# EAGLE design single-gates-SMD (EAGLE 7.1.0)
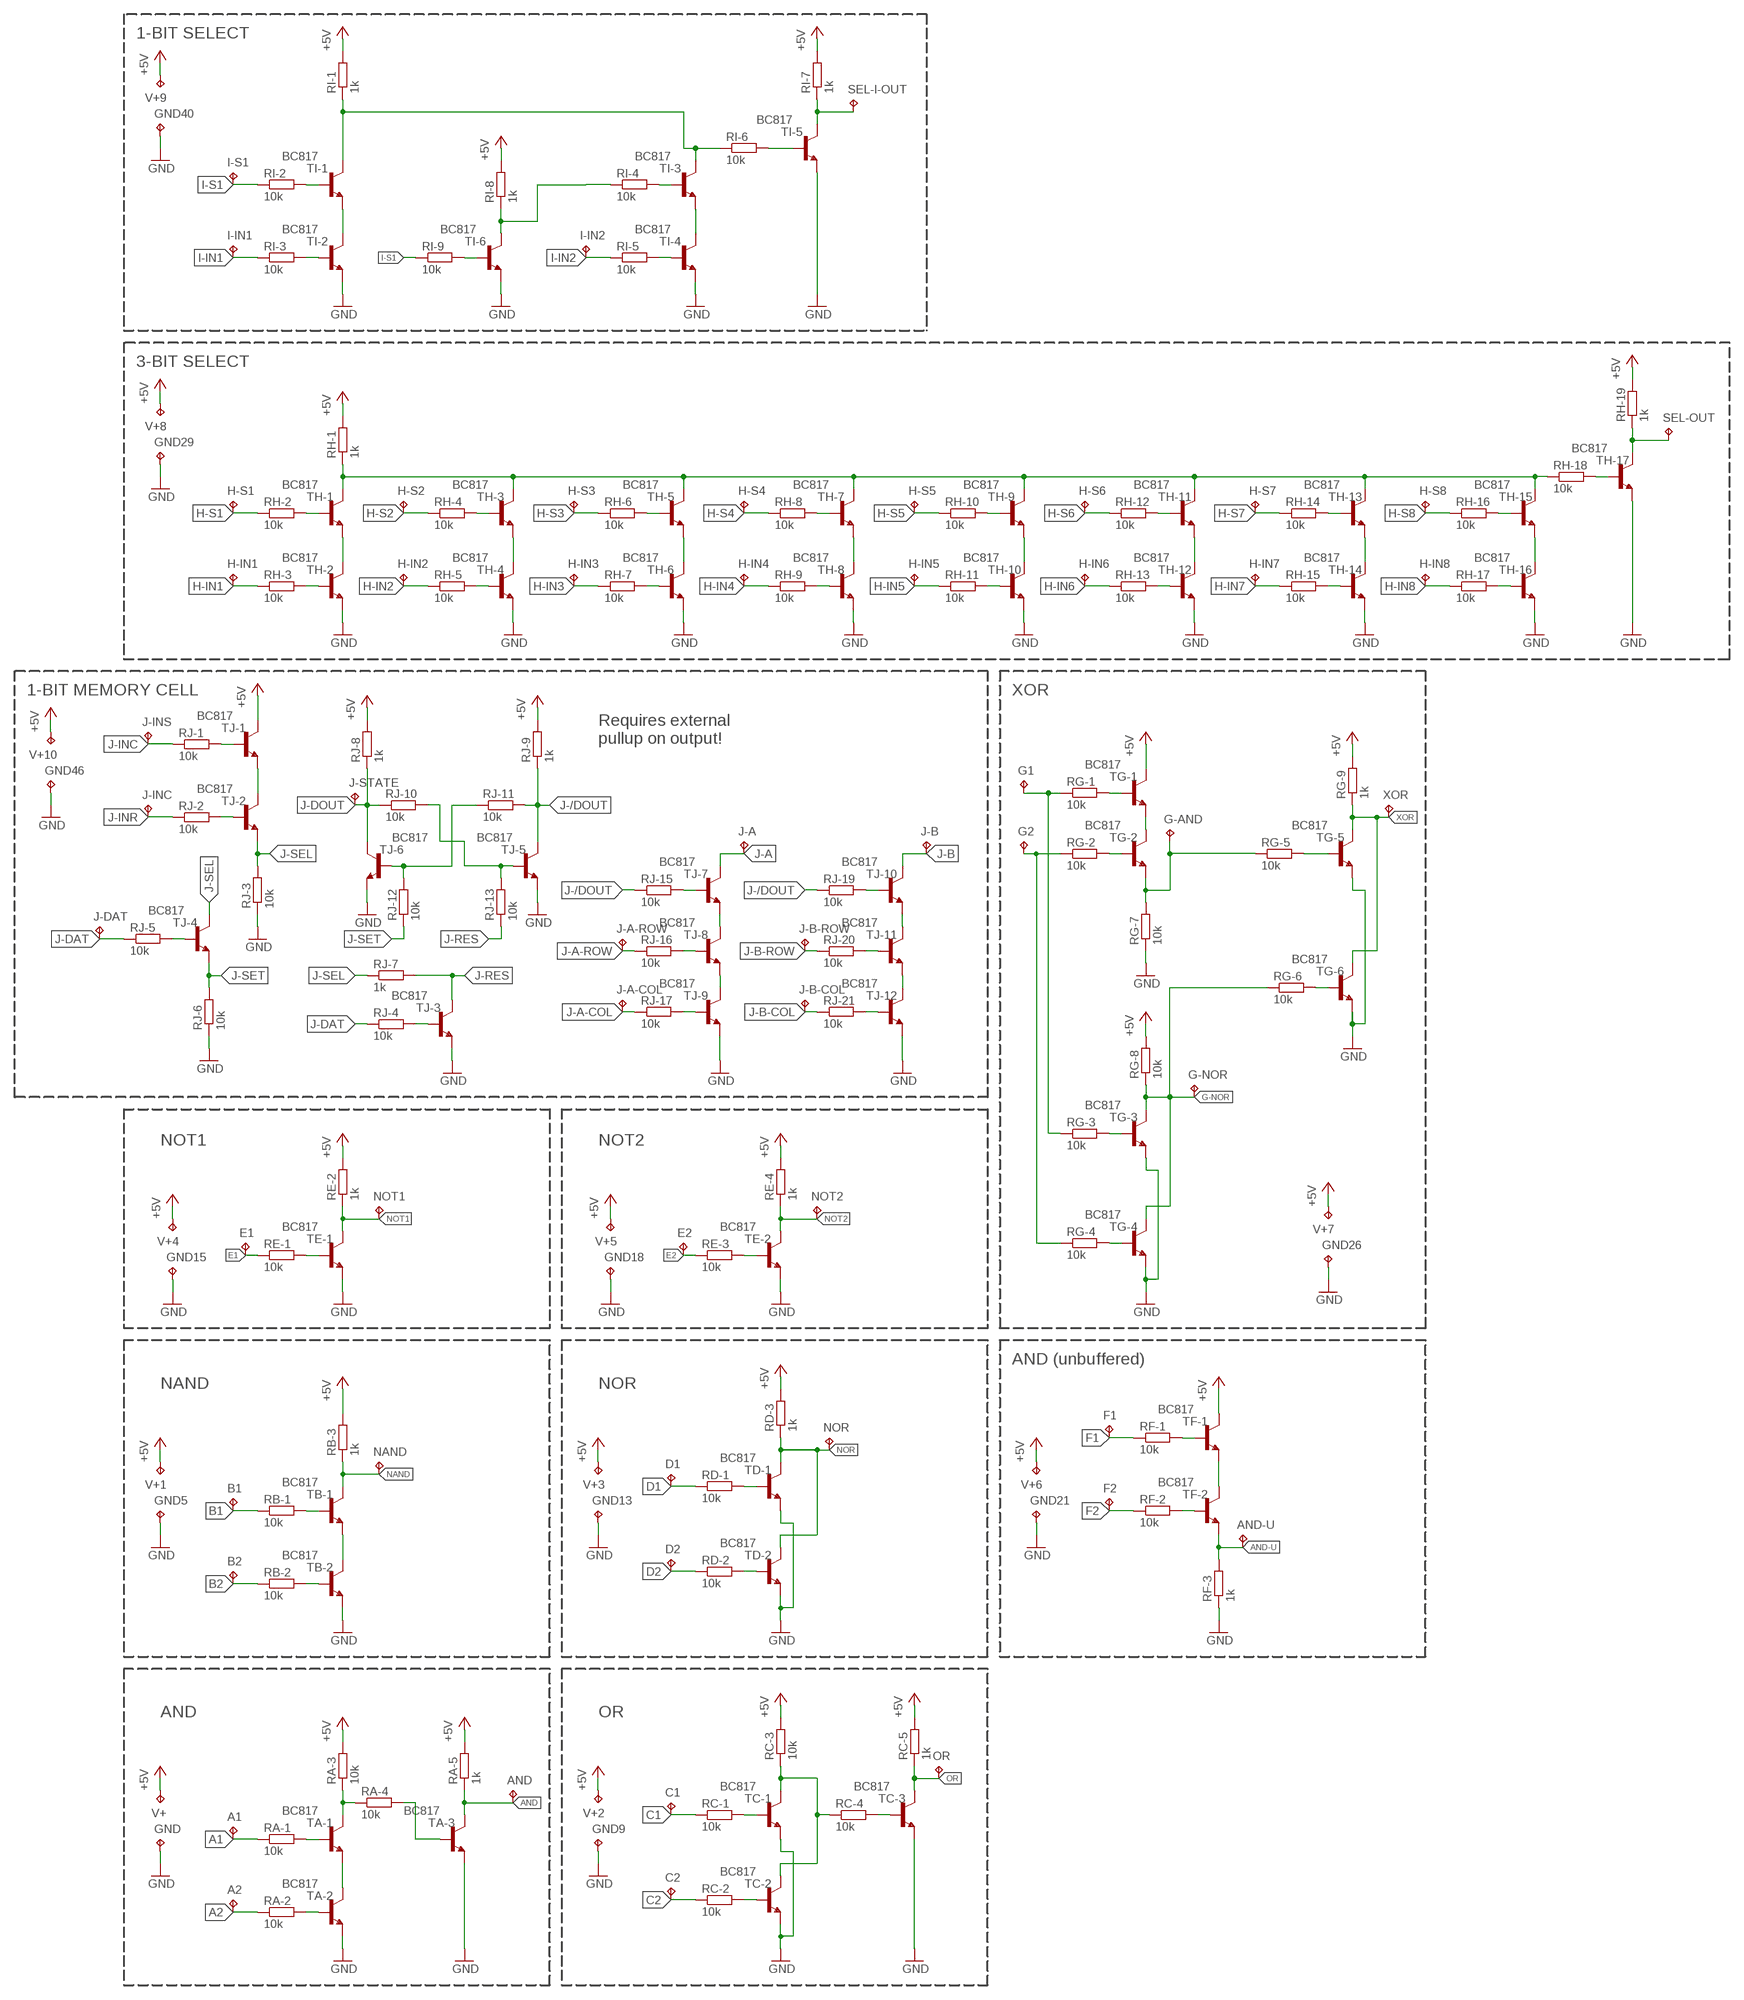
[diagram p0: schematic, sheet 1]

## Parts
A1  TPTP07R  [TP07R]
A2  TPTP07R  [TP07R]
AND  TPTP07R  [TP07R]
AND-U  TPTP07R  [TP07R]
B1  TPTP07R  [TP07R]
B2  TPTP07R  [TP07R]
C1  TPTP07R  [TP07R]
C2  TPTP07R  [TP07R]
D1  TPTP07R  [TP07R]
D2  TPTP07R  [TP07R]
E1  TPTP07R  [TP07R]
E2  TPTP07R  [TP07R]
F1  TPTP07R  [TP07R]
F2  TPTP07R  [TP07R]
G1  TPTP07R  [TP07R]
G2  TPTP07R  [TP07R]
G-AND  TPTP07R  [TP07R]
G-NOR  TPTP07R  [TP07R]
GND  TPTP07R  [TP07R]
GND5  TPTP07R  [TP07R]
GND9  TPTP07R  [TP07R]
GND13  TPTP07R  [TP07R]
GND15  TPTP07R  [TP07R]
GND18  TPTP07R  [TP07R]
GND21  TPTP07R  [TP07R]
GND26  TPTP07R  [TP07R]
GND29  TPTP07R  [TP07R]
GND40  TPTP07R  [TP07R]
GND46  TPTP07R  [TP07R]
H-IN1  TPTP07R  [TP07R]
H-IN2  TPTP07R  [TP07R]
H-IN3  TPTP07R  [TP07R]
H-IN4  TPTP07R  [TP07R]
H-IN5  TPTP07R  [TP07R]
H-IN6  TPTP07R  [TP07R]
H-IN7  TPTP07R  [TP07R]
H-IN8  TPTP07R  [TP07R]
H-S1  TPTP07R  [TP07R]
H-S2  TPTP07R  [TP07R]
H-S3  TPTP07R  [TP07R]
H-S4  TPTP07R  [TP07R]
H-S5  TPTP07R  [TP07R]
H-S6  TPTP07R  [TP07R]
H-S7  TPTP07R  [TP07R]
H-S8  TPTP07R  [TP07R]
I-IN1  TPTP07R  [TP07R]
I-IN2  TPTP07R  [TP07R]
I-S1  TPTP07R  [TP07R]
J-A  TPTP07R  [TP07R]
J-A-COL  TPTP07R  [TP07R]
J-A-ROW  TPTP07R  [TP07R]
J-B  TPTP07R  [TP07R]
J-B-COL  TPTP07R  [TP07R]
J-B-ROW  TPTP07R  [TP07R]
J-DAT  TPTP07R  [TP07R]
J-INC  TPTP07R  [TP07R]
J-INS  TPTP07R  [TP07R]
J-STATE  TPTP07R  [TP07R]
NAND  TPTP07R  [TP07R]
NOR  TPTP07R  [TP07R]
NOT1  TPTP07R  [TP07R]
NOT2  TPTP07R  [TP07R]
OR  TPTP07R  [TP07R]
RA-1  10k  R-EU_R0603  [R0603]
RA-2  10k  R-EU_R0603  [R0603]
RA-3  10k  R-EU_R0603  [R0603]
RA-4  10k  R-EU_R0603  [R0603]
RA-5  1k  R-EU_R0603  [R0603]
RB-1  10k  R-EU_R0603  [R0603]
RB-2  10k  R-EU_R0603  [R0603]
RB-3  1k  R-EU_R0603  [R0603]
RC-1  10k  R-EU_R0603  [R0603]
RC-2  10k  R-EU_R0603  [R0603]
RC-3  10k  R-EU_R0603  [R0603]
RC-4  10k  R-EU_R0603  [R0603]
RC-5  1k  R-EU_R0603  [R0603]
RD-1  10k  R-EU_R0603  [R0603]
RD-2  10k  R-EU_R0603  [R0603]
RD-3  1k  R-EU_R0603  [R0603]
RE-1  10k  R-EU_R0603  [R0603]
RE-2  1k  R-EU_R0603  [R0603]
RE-3  10k  R-EU_R0603  [R0603]
RE-4  1k  R-EU_R0603  [R0603]
RF-1  10k  R-EU_R0603  [R0603]
RF-2  10k  R-EU_R0603  [R0603]
RF-3  1k  R-EU_R0603  [R0603]
RG-1  10k  R-EU_R0603  [R0603]
RG-2  10k  R-EU_R0603  [R0603]
RG-3  10k  R-EU_R0603  [R0603]
RG-4  10k  R-EU_R0603  [R0603]
RG-5  10k  R-EU_R0603  [R0603]
RG-6  10k  R-EU_R0603  [R0603]
RG-7  10k  R-EU_R0603  [R0603]
RG-8  10k  R-EU_R0603  [R0603]
RG-9  1k  R-EU_R0603  [R0603]
RH-1  1k  R-EU_R0603  [R0603]
RH-2  10k  R-EU_R0603  [R0603]
RH-3  10k  R-EU_R0603  [R0603]
RH-4  10k  R-EU_R0603  [R0603]
RH-5  10k  R-EU_R0603  [R0603]
RH-6  10k  R-EU_R0603  [R0603]
RH-7  10k  R-EU_R0603  [R0603]
RH-8  10k  R-EU_R0603  [R0603]
RH-9  10k  R-EU_R0603  [R0603]
RH-10  10k  R-EU_R0603  [R0603]
RH-11  10k  R-EU_R0603  [R0603]
RH-12  10k  R-EU_R0603  [R0603]
RH-13  10k  R-EU_R0603  [R0603]
RH-14  10k  R-EU_R0603  [R0603]
RH-15  10k  R-EU_R0603  [R0603]
RH-16  10k  R-EU_R0603  [R0603]
RH-17  10k  R-EU_R0603  [R0603]
RH-18  10k  R-EU_R0603  [R0603]
RH-19  1k  R-EU_R0603  [R0603]
RI-1  1k  R-EU_R0603  [R0603]
RI-2  10k  R-EU_R0603  [R0603]
RI-3  10k  R-EU_R0603  [R0603]
RI-4  10k  R-EU_R0603  [R0603]
RI-5  10k  R-EU_R0603  [R0603]
RI-6  10k  R-EU_R0603  [R0603]
RI-7  1k  R-EU_R0603  [R0603]
RI-8  1k  R-EU_R0603  [R0603]
RI-9  10k  R-EU_R0603  [R0603]
RJ-1  10k  R-EU_R0603  [R0603]
RJ-2  10k  R-EU_R0603  [R0603]
RJ-3  10k  R-EU_R0603  [R0603]
RJ-4  10k  R-EU_R0603  [R0603]
RJ-5  10k  R-EU_R0603  [R0603]
RJ-6  10k  R-EU_R0603  [R0603]
RJ-7  1k  R-EU_R0603  [R0603]
RJ-8  1k  R-EU_R0603  [R0603]
RJ-9  1k  R-EU_R0603  [R0603]
RJ-10  10k  R-EU_R0603  [R0603]
RJ-11  10k  R-EU_R0603  [R0603]
RJ-12  10k  R-EU_R0603  [R0603]
RJ-13  10k  R-EU_R0603  [R0603]
RJ-15  10k  R-EU_R0603  [R0603]
RJ-16  10k  R-EU_R0603  [R0603]
RJ-17  10k  R-EU_R0603  [R0603]
RJ-19  10k  R-EU_R0603  [R0603]
RJ-20  10k  R-EU_R0603  [R0603]
RJ-21  10k  R-EU_R0603  [R0603]
SEL-I-OUT  TPTP07R  [TP07R]
SEL-OUT  TPTP07R  [TP07R]
TA-1  BC817  BC817-40-NPN-SOT23-BEC  [SOT23-BEC]
TA-2  BC817  BC817-40-NPN-SOT23-BEC  [SOT23-BEC]
TA-3  BC817  BC817-40-NPN-SOT23-BEC  [SOT23-BEC]
TB-1  BC817  BC817-40-NPN-SOT23-BEC  [SOT23-BEC]
TB-2  BC817  BC817-40-NPN-SOT23-BEC  [SOT23-BEC]
TC-1  BC817  BC817-40-NPN-SOT23-BEC  [SOT23-BEC]
TC-2  BC817  BC817-40-NPN-SOT23-BEC  [SOT23-BEC]
TC-3  BC817  BC817-40-NPN-SOT23-BEC  [SOT23-BEC]
TD-1  BC817  BC817-40-NPN-SOT23-BEC  [SOT23-BEC]
TD-2  BC817  BC817-40-NPN-SOT23-BEC  [SOT23-BEC]
TE-1  BC817  BC817-40-NPN-SOT23-BEC  [SOT23-BEC]
TE-2  BC817  BC817-40-NPN-SOT23-BEC  [SOT23-BEC]
TF-1  BC817  BC817-40-NPN-SOT23-BEC  [SOT23-BEC]
TF-2  BC817  BC817-40-NPN-SOT23-BEC  [SOT23-BEC]
TG-1  BC817  BC817-40-NPN-SOT23-BEC  [SOT23-BEC]
TG-2  BC817  BC817-40-NPN-SOT23-BEC  [SOT23-BEC]
TG-3  BC817  BC817-40-NPN-SOT23-BEC  [SOT23-BEC]
TG-4  BC817  BC817-40-NPN-SOT23-BEC  [SOT23-BEC]
TG-5  BC817  BC817-40-NPN-SOT23-BEC  [SOT23-BEC]
TG-6  BC817  BC817-40-NPN-SOT23-BEC  [SOT23-BEC]
TH-1  BC817  BC817-40-NPN-SOT23-BEC  [SOT23-BEC]
TH-2  BC817  BC817-40-NPN-SOT23-BEC  [SOT23-BEC]
TH-3  BC817  BC817-40-NPN-SOT23-BEC  [SOT23-BEC]
TH-4  BC817  BC817-40-NPN-SOT23-BEC  [SOT23-BEC]
TH-5  BC817  BC817-40-NPN-SOT23-BEC  [SOT23-BEC]
TH-6  BC817  BC817-40-NPN-SOT23-BEC  [SOT23-BEC]
TH-7  BC817  BC817-40-NPN-SOT23-BEC  [SOT23-BEC]
TH-8  BC817  BC817-40-NPN-SOT23-BEC  [SOT23-BEC]
TH-9  BC817  BC817-40-NPN-SOT23-BEC  [SOT23-BEC]
TH-10  BC817  BC817-40-NPN-SOT23-BEC  [SOT23-BEC]
TH-11  BC817  BC817-40-NPN-SOT23-BEC  [SOT23-BEC]
TH-12  BC817  BC817-40-NPN-SOT23-BEC  [SOT23-BEC]
TH-13  BC817  BC817-40-NPN-SOT23-BEC  [SOT23-BEC]
TH-14  BC817  BC817-40-NPN-SOT23-BEC  [SOT23-BEC]
TH-15  BC817  BC817-40-NPN-SOT23-BEC  [SOT23-BEC]
TH-16  BC817  BC817-40-NPN-SOT23-BEC  [SOT23-BEC]
TH-17  BC817  BC817-40-NPN-SOT23-BEC  [SOT23-BEC]
TI-1  BC817  BC817-40-NPN-SOT23-BEC  [SOT23-BEC]
TI-2  BC817  BC817-40-NPN-SOT23-BEC  [SOT23-BEC]
TI-3  BC817  BC817-40-NPN-SOT23-BEC  [SOT23-BEC]
TI-4  BC817  BC817-40-NPN-SOT23-BEC  [SOT23-BEC]
TI-5  BC817  BC817-40-NPN-SOT23-BEC  [SOT23-BEC]
TI-6  BC817  BC817-40-NPN-SOT23-BEC  [SOT23-BEC]
TJ-1  BC817  BC817-40-NPN-SOT23-BEC  [SOT23-BEC]
TJ-2  BC817  BC817-40-NPN-SOT23-BEC  [SOT23-BEC]
TJ-3  BC817  BC817-40-NPN-SOT23-BEC  [SOT23-BEC]
TJ-4  BC817  BC817-40-NPN-SOT23-BEC  [SOT23-BEC]
TJ-5  BC817  BC817-40-NPN-SOT23-BEC  [SOT23-BEC]
TJ-6  BC817  BC817-40-NPN-SOT23-BEC  [SOT23-BEC]
TJ-7  BC817  BC817-40-NPN-SOT23-BEC  [SOT23-BEC]
TJ-8  BC817  BC817-40-NPN-SOT23-BEC  [SOT23-BEC]
TJ-9  BC817  BC817-40-NPN-SOT23-BEC  [SOT23-BEC]
TJ-10  BC817  BC817-40-NPN-SOT23-BEC  [SOT23-BEC]
TJ-11  BC817  BC817-40-NPN-SOT23-BEC  [SOT23-BEC]
TJ-12  BC817  BC817-40-NPN-SOT23-BEC  [SOT23-BEC]
V+  TPTP07R  [TP07R]
V+1  TPTP07R  [TP07R]
V+2  TPTP07R  [TP07R]
V+3  TPTP07R  [TP07R]
V+4  TPTP07R  [TP07R]
V+5  TPTP07R  [TP07R]
V+6  TPTP07R  [TP07R]
V+7  TPTP07R  [TP07R]
V+8  TPTP07R  [TP07R]
V+9  TPTP07R  [TP07R]
V+10  TPTP07R  [TP07R]
XOR  TPTP07R  [TP07R]

## Nets
+5V: RA-3.2 RA-5.2 RB-3.2 RC-3.2 RC-5.2 RD-3.2 RE-2.2 RE-4.2 RG-8.2 RG-9.2 RH-1.2 RH-19.2 RI-1.2 RI-7.2 RI-8.2 RJ-8.2 RJ-9.2 TF-1.C TG-1.C TJ-1.C V+1.TP V+2.TP V+3.TP V+4.TP V+5.TP V+6.TP V+7.TP V+8.TP V+9.TP V+10.TP V+.TP
A1: A1.TP RA-1.1
A2: A2.TP RA-2.1
AND: AND.TP RA-5.1 TA-3.C
AND-U: AND-U.TP RF-3.2 TF-2.E
B1: B1.TP RB-1.1
B2: B2.TP RB-2.1
C1: C1.TP RC-1.1
C2: C2.TP RC-2.1
D1: D1.TP RD-1.1
D2: D2.TP RD-2.1
E1: E1.TP RE-1.1
E2: E2.TP RE-3.1
F1: F1.TP RF-1.1
F2: F2.TP RF-2.1
G-AND: G-AND.TP RG-5.1 RG-7.2 TG-2.E
G-NOR: G-NOR.TP RG-6.1 RG-8.1 TG-3.C TG-4.C
GND: GND5.TP GND9.TP GND13.TP GND15.TP GND18.TP GND21.TP GND26.TP GND29.TP GND40.TP GND46.TP GND.TP RF-3.1 RG-7.1 RJ-3.1 RJ-6.1 TA-2.E TA-3.E TB-2.E TC-1.E TC-2.E TC-3.E TD-1.E TD-2.E TE-1.E TE-2.E TG-3.E TG-4.E TG-5.E TG-6.E TH-2.E TH-4.E TH-6.E TH-8.E TH-10.E TH-12.E TH-14.E TH-16.E TH-17.E TI-2.E TI-4.E TI-5.E TI-6.E TJ-3.E TJ-5.E TJ-6.E TJ-9.E TJ-12.E
H-IN1: H-IN1.TP RH-3.1
H-IN2: H-IN2.TP RH-5.1
H-IN3: H-IN3.TP RH-7.1
H-IN4: H-IN4.TP RH-9.1
H-IN5: H-IN5.TP RH-11.1
H-IN6: H-IN6.TP RH-13.1
H-IN7: H-IN7.TP RH-15.1
H-IN8: H-IN8.TP RH-17.1
H-S1: H-S1.TP RH-2.1
H-S2: H-S2.TP RH-4.1
H-S3: H-S3.TP RH-6.1
H-S4: H-S4.TP RH-8.1
H-S5: H-S5.TP RH-10.1
H-S6: H-S6.TP RH-12.1
H-S7: H-S7.TP RH-14.1
H-S8: H-S8.TP RH-16.1
I-IN1: I-IN1.TP RI-3.1
I-IN2: I-IN2.TP RI-5.1
I-S1: I-S1.TP RI-2.1 RI-9.1
I-S2: RI-4.1 RI-8.1 TI-6.C
J-/DOUT: RJ-9.1 RJ-11.2 RJ-15.1 RJ-19.1 TJ-5.C
J-A: J-A.TP TJ-7.C
J-A-COL: J-A-COL.TP RJ-17.1
J-A-ROW: J-A-ROW.TP RJ-16.1
J-B: J-B.TP TJ-10.C
J-B-COL: J-B-COL.TP RJ-21.1
J-B-ROW: J-B-ROW.TP RJ-20.1
J-DAT: J-DAT.TP RJ-4.1 RJ-5.1
J-DOUT: J-STATE.TP RJ-8.1 RJ-10.1 TJ-6.C
J-INC: J-INS.TP RJ-1.1
J-INR: J-INC.TP RJ-2.1
J-RES: RJ-7.2 RJ-13.1 TJ-3.C
J-SEL: RJ-3.2 RJ-7.1 TJ-2.E TJ-4.C
J-SET: RJ-6.2 RJ-12.1 TJ-4.E
N$1: RA-1.2 TA-1.B
N$2: RA-3.1 RA-4.1 TA-1.C
N$3: RA-2.2 TA-2.B
N$4: TA-1.E TA-2.C
N$5: RB-1.2 TB-1.B
N$6: RB-2.2 TB-2.B
N$7: RC-1.2 TC-1.B
N$8: TB-1.E TB-2.C
N$9: RC-2.2 TC-2.B
N$10: RC-4.2 TC-3.B
N$11: RC-3.1 RC-4.1 TC-1.C TC-2.C
N$12: RD-1.2 TD-1.B
N$13: RD-2.2 TD-2.B
N$14: RE-1.2 TE-1.B
N$15: RA-4.2 TA-3.B
N$16: RE-3.2 TE-2.B
N$17: RF-1.2 TF-1.B
N$18: RF-2.2 TF-2.B
N$19: TG-1.E TG-2.C
N$20: TF-1.E TF-2.C
N$21: RG-1.2 TG-1.B
N$22: RG-2.2 TG-2.B
N$23: RG-4.2 TG-4.B
N$24: RG-3.2 TG-3.B
N$25: RG-6.2 TG-6.B
N$26: RG-5.2 TG-5.B
N$27: RH-2.2 TH-1.B
N$28: RH-3.2 TH-2.B
N$29: TH-1.E TH-2.C
N$30: G1.TP RG-1.1 RG-3.1
N$31: G2.TP RG-2.1 RG-4.1
N$32: RH-4.2 TH-3.B
N$33: RH-5.2 TH-4.B
N$34: TH-3.E TH-4.C
N$35: RH-6.2 TH-5.B
N$36: RH-7.2 TH-6.B
N$37: TH-5.E TH-6.C
N$38: RH-8.2 TH-7.B
N$39: RH-9.2 TH-8.B
N$40: TH-7.E TH-8.C
N$41: RH-10.2 TH-9.B
N$42: RH-11.2 TH-10.B
N$43: TH-9.E TH-10.C
N$44: RH-12.2 TH-11.B
N$45: RH-13.2 TH-12.B
N$46: TH-11.E TH-12.C
N$47: RH-14.2 TH-13.B
N$48: RH-15.2 TH-14.B
N$49: TH-13.E TH-14.C
N$50: RH-16.2 TH-15.B
N$51: RH-17.2 TH-16.B
N$52: TH-15.E TH-16.C
N$53: RI-2.2 TI-1.B
N$54: RH-18.2 TH-17.B
N$55: RI-3.2 TI-2.B
N$56: TI-1.E TI-2.C
N$57: RI-4.2 TI-3.B
N$58: RI-5.2 TI-4.B
N$59: TI-3.E TI-4.C
N$60: RI-6.2 TI-5.B
N$61: RJ-1.2 TJ-1.B
N$62: RI-9.2 TI-6.B
N$63: RJ-2.2 TJ-2.B
N$64: TJ-1.E TJ-2.C
N$65: RJ-4.2 TJ-3.B
N$66: RJ-5.2 TJ-4.B
N$67: TJ-10.E TJ-11.C
N$68: TJ-7.E TJ-8.C
N$69: RJ-11.1 RJ-12.2 TJ-6.B
N$70: RJ-10.2 RJ-13.2 TJ-5.B
N$71: TJ-8.E TJ-9.C
N$72: RJ-15.2 TJ-7.B
N$73: RJ-16.2 TJ-8.B
N$74: RJ-17.2 TJ-9.B
N$75: TJ-11.E TJ-12.C
N$76: RJ-19.2 TJ-10.B
N$77: RJ-20.2 TJ-11.B
N$78: RJ-21.2 TJ-12.B
NAND: NAND.TP RB-3.1 TB-1.C
NOR: NOR.TP RD-3.1 TD-1.C TD-2.C
NOT1: NOT1.TP RE-2.1 TE-1.C
NOT2: NOT2.TP RE-4.1 TE-2.C
OR: OR.TP RC-5.1 TC-3.C
SEL_INT: RH-1.1 RH-18.1 TH-1.C TH-3.C TH-5.C TH-7.C TH-9.C TH-11.C TH-13.C TH-15.C
SEL_INT1: RI-1.1 RI-6.1 TI-1.C TI-3.C
SEL_OUT: RH-19.1 SEL-OUT.TP TH-17.C
SEL_OUT1: RI-7.1 SEL-I-OUT.TP TI-5.C
XOR: RG-9.1 TG-5.C TG-6.C XOR.TP

## Notes on the sheet
- 1-BIT SELECT
- 3-BIT SELECT
- 1-BIT MEMORY CELL | XOR
- Requires external
  pullup on output!
- NOT1 | NOT2
- AND (unbuffered)
- NAND | NOR
- AND | OR

## Library data of the parts
A1 A2 AND AND-U B1 B2 C1 C2 D1 D2 E1 E2 F1 F2 G1 G2 G-AND G-NOR GND GND5 GND9 GND13 GND15 GND18 GND21 GND26 GND29 GND40 GND46 H-IN1-H-IN8 H-S1-H-S8 I-IN1 I-IN2 I-S1 J-A J-A-COL J-A-ROW J-B J-B-COL J-B-ROW J-DAT J-INC J-INS J-STATE NAND NOR NOT1 NOT2 OR SEL-I-OUT SEL-OUT V+ V+1-V+10 XOR = testpad:TP: Test pad
RA-1-RA-5 RB-1-RB-3 RC-1-RC-5 RD-1-RD-3 RE-1-RE-4 RF-1-RF-3 RG-1-RG-9 RH-1-RH-19 RI-1-RI-9 RJ-1-RJ-13 RJ-15-RJ-17 RJ-19-RJ-21 = p.peter-rcl:R-EU_: RESISTOR, European symbol
TA-1-TA-3 TB-1 TB-2 TC-1-TC-3 TD-1 TD-2 TE-1 TE-2 TF-1 TF-2 TG-1-TG-6 TH-1-TH-17 TI-1-TI-6 TJ-1-TJ-12 = transistor:*-NPN-: NPN Transistror BF959 corrected 2008.03.06

## Board
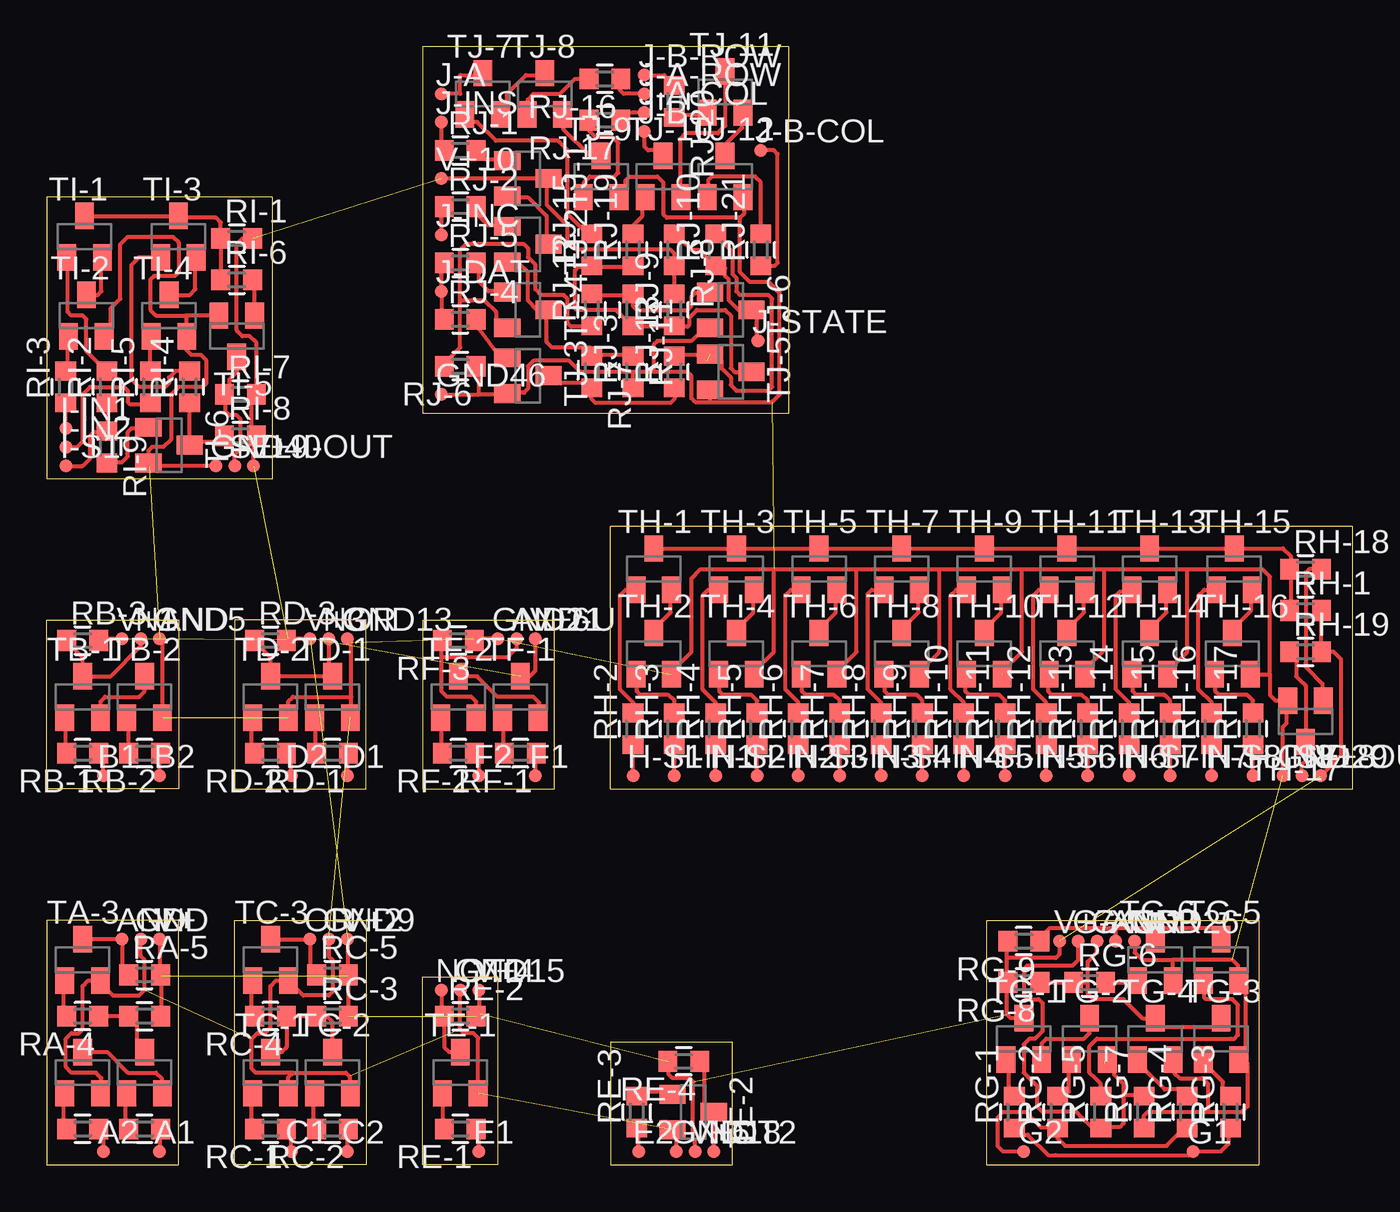
[diagram p1: board, top side]
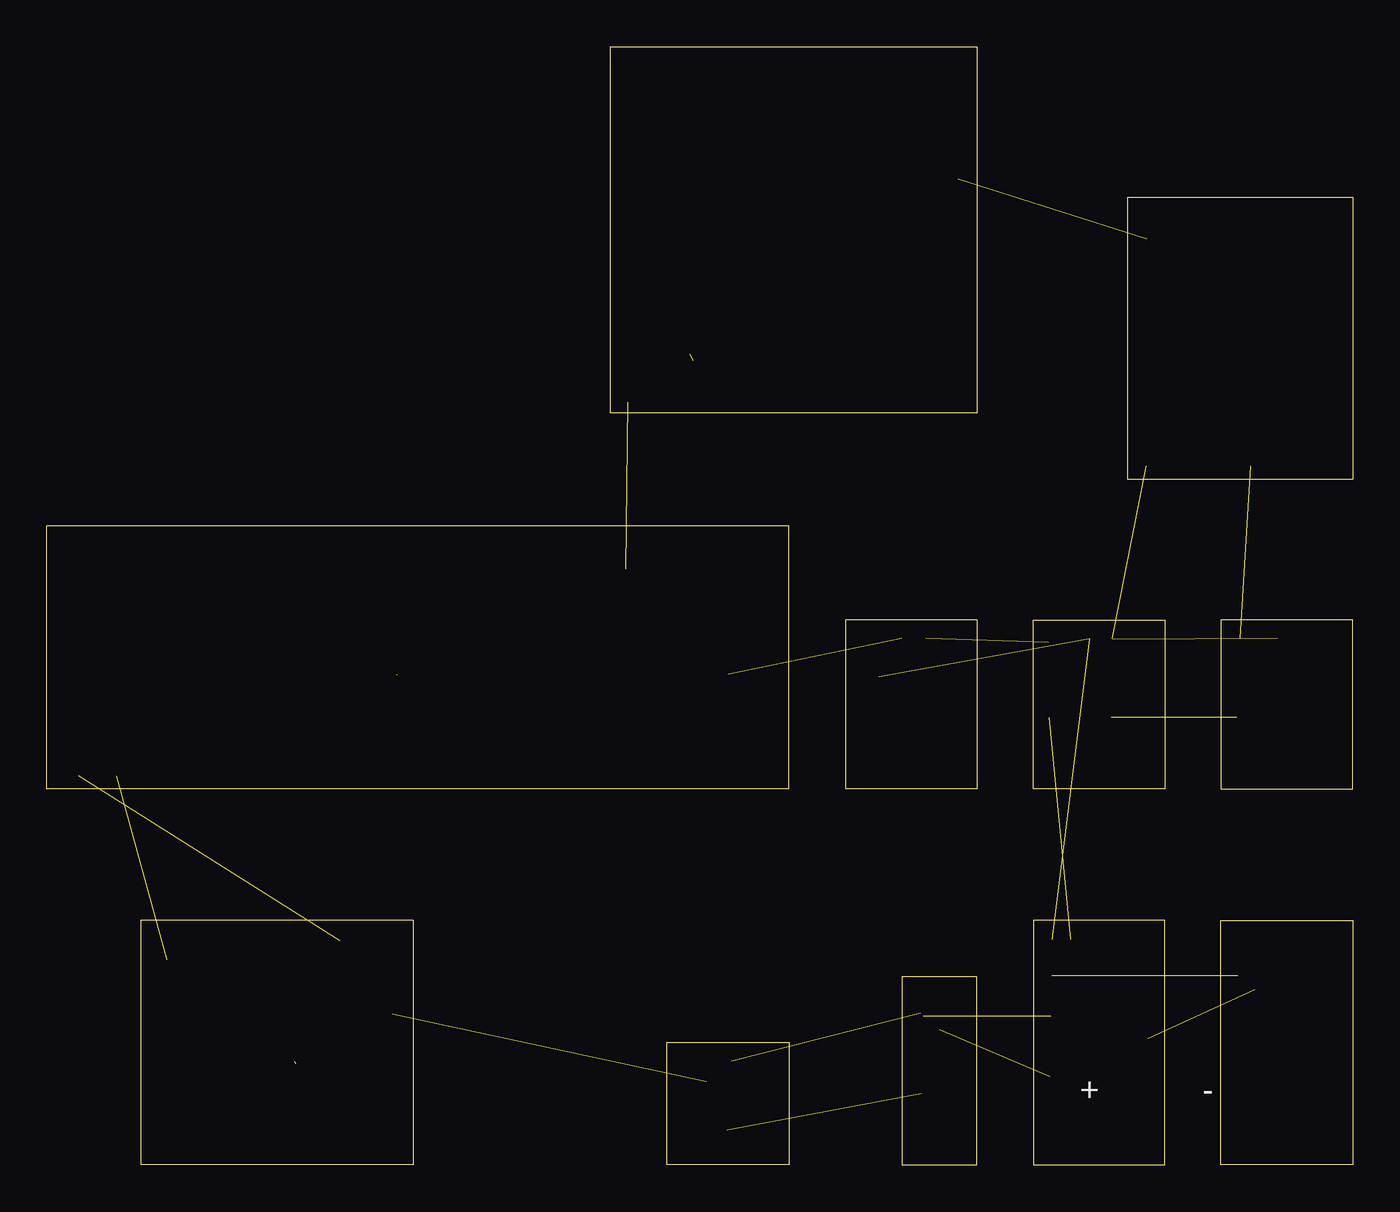
[diagram p2: board, bottom side, seen from below]

Size 69.5 x 59.5 mm. Coordinates in mm from the lower left corner, seen from the top.
Outline: 0,0 7,0 7,13 0,13 0,0
Outline: 0,20 0,29 7,29 7,20 0,20
Outline: 10,0 10,13 17,13 17,0 10,0
Outline: 10,20 17,20 17,29 10,29 10,20
Outline: 20,0 20,10 24,10 24,0 20,0
Outline: 30,0 36.5,0 36.5,6.5 30,6.5 30,0
Outline: 20,29 20,20 27,20 27,29 20,29
Outline: 50,13 50,0 64.5,0 64.5,13 50,13
Outline: 30,20 69.5,20 69.5,34 30,34 30,20
Outline: 12,36.5 0,36.5 0,51.5 12,51.5 12,36.5
Outline: 20,40 39.5,40 39.5,59.5 20,59.5 20,40
Copper layers (1*16): Top 0.035mm / dielectric 1.5mm / Bottom 0.035mm
Design rules "Fusion_eagle_rule_v1.1 *": minimum track width 6mil, minimum drill 12mil, track to track 6mil, track to pad 6mil, pad to pad 6mil, via to via 6mil, smd to smd 0mil, copper to edge 10mil, drill to drill 10mil, minimum pad ring 15mil, minimum via ring 6mil, stop-mask expansion 2mil, vias tented up to drill 100mil, thermal gap 10mil

### Footprints (pad centres in the part's own frame; a part is rotated, then mirrored left to right if it is on the bottom)
TP07R = smd 0.7 x 0.7: TP 0,0
R0603 = smd 1 x 1.1: 1 -0.85,0; 2 0.85,0
SOT23-BEC = smd 1 x 1.4: B -0.95,-1.1; C 0,1.1; E 0.95,-1.1

### Placement (x,y rotation side)
A1  6,0.7 0 top
A2  3,0.7 0 top
AND  4,12 0 top
AND-U  25,28 0 top
B1  3,20.7 0 top
B2  6,20.7 0 top
C1  13,0.7 0 top
C2  16,0.7 0 top
D1  16,20.7 0 top
D2  13,20.7 0 top
E1  23,0.7 0 top
E2  31.5,0.7 0 top
F1  26,20.7 0 top
F2  23,20.7 0 top
G1  61,0.7 0 top
G2  52,0.7 0 top
G-AND  54.9,11.9 0 top
G-NOR  55.9,11.9 0 top
GND  5,12 0 top
GND5  6,28 0 top
GND9  15,12 0 top
GND13  16,28 0 top
GND15  22,9.3 0 top
GND18  33.5,0.7 0 top
GND21  24,28 0 top
GND26  57.9,11.9 0 top
GND29  65.8,20.7 0 top
GND40  9,37.2 0 top
GND46  21,41 0 top
H-IN1  33.4,20.7 0 top
H-IN2  37.8,20.7 0 top
H-IN3  42.2,20.7 0 top
H-IN4  46.6,20.7 0 top
H-IN5  51,20.7 0 top
H-IN6  55.4,20.7 0 top
H-IN7  59.8,20.7 0 top
H-IN8  64.2,20.7 0 top
H-S1  31.2,20.7 0 top
H-S2  35.6,20.7 0 top
H-S3  40,20.7 0 top
H-S4  44.4,20.7 0 top
H-S5  48.8,20.7 0 top
H-S6  53.2,20.7 0 top
H-S7  57.6,20.7 0 top
H-S8  62,20.7 0 top
I-IN1  1,39.2 0 top
I-IN2  1,38.2 0 top
I-S1  1,37.2 0 top
J-A  21,57 0 top
J-A-COL  31.8,56 0 top
J-A-ROW  31.8,57 0 top
J-B  31.8,55 0 top
J-B-COL  38,54 0 top
J-B-ROW  31.8,58 0 top
J-DAT  21,46.5 0 top
J-INC  21,49.5 0 top
J-INS  21,55.5 0 top
J-STATE  37.85,43.85 0 top
NAND  5,28 0 top
NOR  15,28 0 top
NOT1  21,9.3 0 top
NOT2  35.5,0.7 0 top
OR  14,12 0 top
RA-1  5.2,1.9 180 top
RA-2  1.9,1.9 180 top
RA-3  5.2,7.9 0 top
RA-4  1.9,7.9 180 top
RA-5  5.2,10.1 0 top
RB-1  1.9,21.9 180 top
RB-2  5.2,21.9 180 top
RB-3  1.9,27.9 0 top
RC-1  11.9,1.9 180 top
RC-2  15.2,1.9 180 top
RC-3  15.2,7.9 0 top
RC-4  11.9,7.9 180 top
RC-5  15.2,10.1 0 top
RD-1  15.2,21.9 180 top
RD-2  11.9,21.9 180 top
RD-3  11.9,27.9 0 top
RE-1  22,1.9 180 top
RE-2  22,7.9 0 top
RE-3  31.4,2.8 90 top
RE-4  33.9,5.5 180 top
RF-1  25.2,21.9 180 top
RF-2  21.9,21.9 180 top
RF-3  21.9,27.9 180 top
RG-1  51.5,2.8 90 top
RG-2  53.8,2.8 90 top
RG-3  63,2.8 90 top
RG-4  60.7,2.8 90 top
RG-5  56.1,2.8 90 top
RG-6  55.5,9.7 0 top
RG-7  58.4,2.8 90 top
RG-8  52,9.7 180 top
RG-9  52,11.9 180 top
RH-1  67,29.5 0 top
RH-2  31.2,23.2 90 top
RH-3  33.4,23.2 90 top
RH-4  35.6,23.2 90 top
RH-5  37.8,23.2 90 top
RH-6  40,23.2 90 top
RH-7  42.2,23.2 90 top
RH-8  44.4,23.2 90 top
RH-9  46.6,23.2 90 top
RH-10  48.8,23.2 90 top
RH-11  51,23.2 90 top
RH-12  53.2,23.2 90 top
RH-13  55.4,23.2 90 top
RH-14  57.6,23.2 90 top
RH-15  59.8,23.2 90 top
RH-16  62,23.2 90 top
RH-17  64.2,23.2 90 top
RH-18  67,31.7 0 top
RH-19  67,27.3 0 top
RI-1  10.1,49.3 0 top
RI-2  3.2,41.4 90 top
RI-3  1,41.4 90 top
RI-4  7.6,41.4 90 top
RI-5  5.5,41.4 90 top
RI-6  10.1,47.1 0 top
RI-7  10.3,41 0 top
RI-8  10.3,38.8 0 top
RI-9  3.2,38.2 270 top
RJ-1  22,54 0 top
RJ-2  22,51 0 top
RJ-3  31.2,42.2 90 top
RJ-4  22,45 0 top
RJ-5  22,48 0 top
RJ-6  22,42.5 180 top
RJ-7  29,42.2 270 top
RJ-8  33.4,48.7 270 top
RJ-9  33.4,45.5 90 top
RJ-10  35.6,48.7 90 top
RJ-11  31.2,45.5 270 top
RJ-12  29,45.5 90 top
RJ-13  33.4,42.2 90 top
RJ-15  29,48.7 90 top
RJ-16  29.7,57.8 180 top
RJ-17  29.7,55.6 180 top
RJ-19  31.2,48.7 90 top
RJ-20  33.4,56.6 270 top
RJ-21  38,48.7 90 top
SEL-I-OUT  10,37.2 0 top
SEL-OUT  66.8,20.7 0 top
TA-1  5.2,4.9 0 top
TA-2  1.9,4.9 0 top
TA-3  1.9,10.9 0 top
TB-1  1.9,24.9 0 top
TB-2  5.2,24.9 0 top
TC-1  11.9,4.9 0 top
TC-2  15.2,4.9 0 top
TC-3  11.9,10.9 0 top
TD-1  15.2,24.9 0 top
TD-2  11.9,24.9 0 top
TE-1  22,4.9 0 top
TE-2  34.4,2.8 270 top
TF-1  25.2,24.9 0 top
TF-2  21.9,24.9 0 top
TG-1  52,6.7 0 top
TG-2  55.5,6.7 0 top
TG-3  62.5,6.7 0 top
TG-4  59,6.7 0 top
TG-5  62.5,10.9 0 top
TG-6  59,10.9 0 top
TH-1  32.3,31.7 0 top
TH-2  32.3,27.2 0 top
TH-3  36.7,31.7 0 top
TH-4  36.7,27.2 0 top
TH-5  41.1,31.7 0 top
TH-6  41.1,27.2 0 top
TH-7  45.5,31.7 0 top
TH-8  45.5,27.2 0 top
TH-9  49.9,31.7 0 top
TH-10  49.9,27.2 0 top
TH-11  54.3,31.7 0 top
TH-12  54.3,27.2 0 top
TH-13  58.7,31.7 0 top
TH-14  58.7,27.2 0 top
TH-15  63.2,31.7 0 top
TH-16  63.1,27.2 0 top
TH-17  67,23.6 180 top
TI-1  2,49.4 0 top
TI-2  2.1,45.2 0 top
TI-3  7,49.4 0 top
TI-4  6.5,45.2 0 top
TI-5  10.1,44.1 180 top
TI-6  6.5,38.3 270 top
TJ-1  25.6,52.5 270 top
TJ-2  25.6,49 270 top
TJ-3  25.6,42 270 top
TJ-4  25.6,45.5 270 top
TJ-5  36.4,42.2 270 top
TJ-6  36.4,45.5 270 top
TJ-7  23.2,57 0 top
TJ-8  26.5,57 0 top
TJ-9  29.5,52.6 0 top
TJ-10  32.8,52.6 0 top
TJ-11  36.1,57.1 0 top
TJ-12  36.1,52.6 0 top
V+  6,12 0 top
V+1  4,28 0 top
V+2  16,12 0 top
V+3  14,28 0 top
V+4  23,9.3 0 top
V+5  34.5,0.7 0 top
V+6  26,28 0 top
V+7  53.9,11.9 0 top
V+8  67.8,20.7 0 top
V+9  11,37.2 0 top
V+10  21,52.5 0 top
XOR  56.9,11.9 0 top

### Tracks (layer width: path | path; a pad name or v marks a point on that pad's centre or on a via)
+5V  (10 unrouted)
  Top 0.2: RB-3.2 2.75,27.95 2.8,28 V+1.TP | RC-3.2 RC-5.2 16,10.05 V+2.TP | RD-3.2 12.75,27.95 12.8,28 V+3.TP | V+4.TP 23,8.05 RE-2.2 | V+5.TP 34.5,1.3 34.4,1.4 34.4,4.4 34.2,4.6 33.3,4.6 33.1,4.8 33.1,5.55 RE-4.2 | TF-1.C 25.7,26 26,26.3 V+6.TP | RA-3.2 6.1,7.9 6.1,10.05 RA-5.2 6,10.15 V+.TP | 51.1,11 51.1,9.7 RG-8.2 51.1,9.65 51.1,8 51.3,7.8 TG-1.C | 51.1,11 51.1,11.75 RG-9.2 51,11.8 | V+7.TP 53.9,11.2 53.7,11 51.1,11 | RH-1.2 67.8,29.5 67.8,27.35 RH-19.2 68.5,27.3 68.9,26.9 68.9,21.8 V+8.TP | RI-8.2 10.9,38.8 | 10.9,38.8 10.9,40.75 RI-7.2 11.15,43.75 10.8,44.1 10.4,44.1 10.1,44.4 10.1,49 10.4,49.3 RI-1.2 | V+9.TP 11,38.7 10.9,38.8 | 26.6,52.6 26.6,52.9 26.7,52.8 TJ-1.C | 26.6,52.6 TJ-1.C | 27.1,52.5 TJ-1.C | 26.6,52.6 26.6,52.5 | 26.6,52.5 V+10.TP | TJ-1.C 26.6,52.5 | 33.4,46.3 RJ-9.2 RJ-8.2 33.45,47.9 33.4,47.9 33.4,48.5 33.2,48.7 28.2,48.7 27.7,49.2 27.7,50 26.6,51.1 26.6,52.5
A1
  Top 0.2: RA-1.1 6.1,1.9 6,1.8 A1.TP
A2
  Top 0.2: RA-2.1 2.8,1.9 3,1.8 A2.TP
AND
  Top 0.2: TA-3.C AND.TP 4,10.45 RA-5.1
AND-U
  Top 0.2: TF-2.E 22.85,24.65 22.6,24.9 21.3,24.9 21,25.2 21,27 | 21,27 21,27.85 RF-3.2 | AND-U.TP 25,27.5 24.5,27 21,27
B1
  Top 0.2: B1.TP 3,21.85 RB-1.1
B2
  Top 0.2: B2.TP 6,21.85 RB-2.1
C1
  Top 0.2: C1.TP 13,1.8 12.9,1.85 RC-1.1
C2
  Top 0.2: C2.TP 16,1.95 RC-2.1
D1
  Top 0.2: D1.TP 16,21.65 RD-1.1
D2
  Top 0.2: D2.TP 13,21.75 RD-2.1
E1
  Top 0.2: E1.TP 23,1.75 RE-1.1
E2
  Top 0.2: E2.TP 31.5,2 31.45,2.05 RE-3.1
F1
  Top 0.2: F1.TP 26,21.5 26,21.85 RF-1.1
F2
  Top 0.2: F2.TP 23,20.8 23,21.65 RF-2.1
G-AND  (1 unrouted)
  Top 0.2: TG-2.E 56.4,5.55 56.75,5.55 56.8,5.5 56.8,5 56.8,4.8 57.3,4.3 57.3,3.7 | 56.5,5.65 TG-2.E | 58.35,3.6 RG-7.2 58.4,3.7 57.3,3.7 | 56.35,5.5 TG-2.E | 57.3,3.6 57.3,3.5 | 57.3,3.5 57.3,2.2 57.1,2 56.15,2 RG-5.1 55.65,1.95 55.1,2.5 54.8,2.8 53,2.8 52.7,3.1 52.7,4.2 52,4.9 52,6.4 52.3,6.7 52.6,6.7 53,7.1 53,8.6 52.8,8.8 52.2,8.8 52,9 52,10.4 52.2,10.6 54.6,10.6 54.9,10.9 G-AND.TP | 56.2,5.4 56.25,5.4 | 57.3,3.7 57.3,3.6 | 57.3,3.6 57.3,3.5 | 57.3,3.5 57.3,3.6
G-NOR
  Top 0.2: TG-3.C 62.5,7.3 59.1,7.3 59,7.4 TG-4.C 58.3,7.8 58.2,7.9 57.8,8.3 57.3,8.8 55.7,8.8 55.4,9.1 55.4,9.7 | RG-8.1 RG-6.1 55,9.7 55.4,9.7 | 55.4,9.7 55.4,10.8 55.9,11.3 G-NOR.TP
GND  (11 unrouted)
  Top 0.2: TA-2.E 2.9,3.8 2.9,4.6 2.6,4.9 1.3,4.9 1,5.2 1,6.7 1.3,7 1.7,7 1.9,7.2 1.9,9.5 2.2,9.8 TA-3.E 2.85,9.65 3.5,9 4.9,9 5.2,9.3 5.2,10.9 5,11.1 GND.TP | TB-2.E 6.15,27.85 GND5.TP | TC-1.E 12.85,4.65 13.1,4.9 | 13.1,4.9 15.9,4.9 16.1,4.7 16.1,3.85 TC-2.E | GND9.TP 15,11.1 15.2,10.9 15.2,9.2 15,9 13.65,9 TC-3.E 12.2,9.8 11.9,9.5 11.9,7.3 11.6,7 11.2,7 10.9,6.7 10.9,5.1 11.1,4.9 13.1,4.9 | TD-1.E 16.15,23.95 16.2,24 16.2,24.9 | 16.2,24.9 16.2,27.8 GND13.TP | TD-2.E 12.85,24.65 13.1,24.9 16.2,24.9 | TE-1.E 22.95,6.75 22.7,7 22.2,7 22,7.2 GND15.TP | GND21.TP 22.7,28 22.75,27.95 RF-3.1 | RG-7.1 58.4,2.6 58.6,2.8 61.8,2.8 | 61.8,2.8 63.6,2.8 63.9,3.1 63.9,5.4 63.8,5.5 63.8,5.6 63.75,5.55 63.4,5.55 TG-3.E | TG-4.E 60,5.6 60,4.9 60.3,4.6 61.5,4.6 61.8,4.3 61.8,2.8 | TG-3.E 63.45,5.65 63.5,5.7 | 59.9,10.9 63.1,10.9 63.4,10.6 63.4,9.75 TG-5.E 63.5,9.65 63.75,9.65 63.8,9.6 63.8,5.95 TG-3.E | 59.9,10.9 59.9,9.75 TG-6.E | GND26.TP 57.9,11.3 58.3,10.9 59.9,10.9 | GND18.TP 33.5,1.65 TE-2.E | TH-2.E 33.25,26.15 33.3,26.2 33.3,26.3 34.3,27.3 34.3,31.2 34.8,31.7 38.7,31.7 | 38.7,31.7 43.1,31.7 | 43.1,31.7 47.5,31.7 | 47.5,31.7 51.9,31.7 | 51.9,31.7 56.3,31.7 | 56.3,31.7 60.7,31.7 | 60.7,31.7 64.7,31.7 65.1,31.3 65.1,26.1 | TH-4.E 37.65,26.15 37.7,26.2 37.7,26.3 38.7,27.3 38.7,31.7 | TH-6.E 42.1,26.1 42.1,26.3 43.1,27.3 43.1,31.7 | TH-8.E 46.5,26.1 46.5,26.3 47.5,27.3 47.5,31.7 | 51,26.1 50.9,26.1 | 50.8,26.1 50.9,26.1 | 50.9,26.1 50.9,26.3 51.9,27.3 51.9,31.7 | TH-12.E 55.3,26.1 55.3,26.4 56.3,27.4 56.3,31.7 | TH-14.E 59.7,26.1 59.7,26.3 60.7,27.3 60.7,31.7 | TH-16.E 65.1,26.1 | 65.1,26.1 65.1,25 65.4,24.7 TH-17.E 66,24.65 66,23.5 65.8,23.3 GND29.TP
  Top 0.2: TI-4.E 7.5,44.3 | TI-2.E 3.4,44.1 3.4,45.6 3.9,46.1 3.9,49 4.3,49.4 6.7,49.4 7,49.1 7,47.5 6.8,47.3 5.7,47.3 5.5,47.1 5.5,45.5 5.8,45.2 7.4,45.2 | 7.4,45.2 7.4,44.15 TI-4.E | TI-4.E 7.45,43.35 7.7,43.1 8.2,43.1 8.5,42.8 8.5,41.6 8.3,41.4 7,41.4 6.6,41 6.6,38.6 6.2,38.2 5.6,38.2 5.4,38 TI-6.E 5.45,37.2 GND40.TP | TI-5.E 7.4,45.2 | 23,41 24.1,41 24.25,41.15 24.4,41.15 TJ-3.E 24.55,41.1 25.4,41.1 25.6,41.3 25.6,42.5 25.9,42.8 27.8,42.8 28.4,42.2 31.2,42.2 | 23,41 23,42.35 RJ-6.1 | GND46.TP 23,41 | RJ-3.1 31.2,42.2 | 32.3,42.2 34.1,42.2 34.3,42 34.3,40.8 34.5,40.6 35.3,40.6 | 32.3,42.2 31.2,42.2 | TJ-9.E 30.8,51.4 30.8,52.4 31,52.6 32.5,52.6 32.8,52.3 32.8,50.6 33,50.4 36.9,50.4 | TJ-12.E 37.1,51.5 37.1,50.6 36.9,50.4 | TJ-5.E 35.3,40.6 | TJ-6.E 35.05,44.55 34.3,43.85 32.5,43.85 32.3,43.65 32.3,42.2 | 35.3,40.6 38.6,40.6 39,41 39,46.4 38.4,47 37.4,47 36.9,47.5 36.9,50.4
H-IN1
  Top 0.2: H-IN1.TP RH-3.1
H-IN2
  Top 0.2: H-IN2.TP RH-5.1
H-IN3
  Top 0.2: H-IN3.TP RH-7.1
H-IN4
  Top 0.2: H-IN4.TP RH-9.1
H-IN5
  Top 0.2: H-IN5.TP RH-11.1
H-IN6
  Top 0.2: H-IN6.TP RH-13.1
H-IN7
  Top 0.2: H-IN7.TP RH-15.1
H-IN8
  Top 0.2: H-IN8.TP RH-17.1
H-S1
  Top 0.2: H-S1.TP RH-2.1
H-S2
  Top 0.2: H-S2.TP RH-4.1
H-S3
  Top 0.2: H-S3.TP RH-6.1
H-S4
  Top 0.2: H-S4.TP RH-8.1
H-S5
  Top 0.2: H-S5.TP RH-10.1
H-S6
  Top 0.2: H-S6.TP RH-12.1
H-S7
  Top 0.2: H-S7.TP RH-14.1
H-S8
  Top 0.2: H-S8.TP RH-16.1
I-IN1
  Top 0.2: I-IN1.TP 1,39.3 RI-3.1
I-IN2
  Top 0.2: I-IN2.TP 1.6,38.2 1.9,38.5 1.9,41 2.3,41.4 4.1,41.4 4.3,41.2 4.3,40.6 4.4,40.5 5.45,40.5 RI-5.1
I-S1
  Top 0.2: I-S1.TP 1.9,37.2 2.3,37.6 2.3,38.8 2.5,39 3.15,39 RI-9.1 RI-2.1
I-S2
  Top 0.2: TI-6.C 7.8,38.2 8.1,38.5 | 8.1,38.5 9.15,38.5 RI-8.1 | 8.1,38.5 7.9,38.5 TI-6.C | TI-6.C RI-4.1
J-/DOUT
  Top 0.2: RJ-19.1 31.15,47.8 29,47.8 RJ-15.1 28.95,47.8 28.3,47.8 28.1,47.6 28.1,45.6 28.2,45.5 30.3,45.5 31.15,44.65 RJ-11.2 31.25,44.6 33.4,44.6 RJ-9.1 33.45,44.6 34.1,44.6 34.2,44.7 34.2,45.1 34.6,45.5 36.1,45.5 36.4,45.2 36.4,42.4 36.6,42.2 TJ-5.C
J-A
  Top 0.2: TJ-7.C 23.4,58 22,58 22,57 J-A.TP
J-A-COL
  Top 0.2: J-A-COL.TP 30.75,56 RJ-17.1
J-A-ROW
  Top 0.2: J-A-ROW.TP 30.7,57 30.5,57.2 30.5,57.75 RJ-16.1
J-B
  Top 0.2: TJ-10.C 32.6,54 32,54 31.8,54.2 J-B.TP
J-B-COL
  Top 0.2: RJ-21.1 38.75,47.85 38.9,48 38.9,53.8 38.7,54 J-B-COL.TP
J-B-ROW
  Top 0.2: J-B-ROW.TP 32.85,58 RJ-20.1
J-DAT
  Top 0.2: 21,45 RJ-4.1 21,45.15 J-DAT.TP 21,47.85 RJ-5.1 21,48
J-DOUT
  Top 0.2: RJ-8.1 33.75,49.2 33.8,49.2 34.3,48.7 34.7,48.7 35.2,48.2 35.25,48.2 RJ-10.1 | 35.65,47.8 RJ-10.1 | RJ-10.1 35.7,47.75 36.1,47.7 36.1,47.3 36.3,47.1 36.3,46 36.8,45.5 TJ-6.C 37.8,45.2 37.8,43.8 J-STATE.TP
J-INC
  Top 0.2: RJ-1.1 21,54 J-INS.TP
J-INR
  Top 0.2: J-INC.TP 21,50.85 RJ-2.1
J-RES
  Top 0.2: TJ-3.C 26.9,41.6 29,41.6 RJ-7.2 29,40.75 29.2,40.55 33.2,40.55 33.4,40.75 RJ-13.1
J-SEL
  Top 0.2: 24.6,48 24.55,48.05 TJ-2.E 24.55,48 25.1,48 25.6,47.5 25.6,46 26.1,45.5 26.6,45.5 26.7,45.6 | TJ-4.C 26.6,45.6 26.7,45.6 | 26.8,45.5 TJ-4.C | 26.7,45.6 26.8,45.5 | 26.8,45.5 27.1,45.5 | TJ-4.C 26.6,45.4 26.6,43.8 26.9,43.5 28.9,43.5 29,43.2 RJ-7.1 | RJ-3.2 31.2,43.1 29.05,43.1 RJ-7.1 | RJ-7.1 29,43.1
J-SET
  Top 0.2: 24.55,44.5 TJ-4.E 24.05,44.55 23.9,45 23.9,45.4 23.3,46 22,46 | RJ-6.2 21.15,42.65 22,43.5 22,46 | 22,46 22,48.7 22.3,49 25.4,49 25.6,48.8 25.6,48.3 26,47.9 26,46.6 26.3,46.3 27.5,46.3 27.7,46.1 27.7,44.8 27.9,44.6 28.9,44.6 28.95,44.65 RJ-12.1
N$1
  Top 0.2: RA-1.2 4.3,1.9 4.2,2 4.2,3.75 TA-1.B
N$2
  Top 0.2: 2.8,7.85 RA-4.1 RA-3.1 | RA-3.1 4.4,7.9 RA-3.1 | TA-1.C 5.2,6.2 4.9,6.5 4.8,6.6 4.8,7.4 4.7,7.5 4.7,7.55 RA-3.1
N$3
  Top 0.2: RA-2.2 0.9,1.9 0.9,3.75 TA-2.B
N$4
  Top 0.2: TA-2.C 3.2,6 4.3,4.9 5.8,4.9 6.1,4.6 6.1,3.85 TA-1.E
N$5
  Top 0.2: RB-1.2 1.05,21.95 1,22 1,23.75 TB-1.B
N$6
  Top 0.2: RB-2.2 4.35,23.7 TB-2.B
N$7
  Top 0.2: RC-1.2 11,1.9 10.9,2 10.9,3.75 TC-1.B
N$8
  Top 0.2: TB-1.E 2.85,24.65 3.1,24.9 4.9,24.9 5.2,25.2 TB-2.C
N$9
  Top 0.2: RC-2.2 14.2,1.9 14.2,3.75 TC-2.B
N$10
  Top 0.2: RC-4.2 10.9,7.9 10.9,9.75 TC-3.B
N$11
  Top 0.2: TC-2.C 15.2,7.6 14.9,7.9 RC-3.1 RC-4.1 12.75,6.25 12.5,6 TC-1.C
N$12
  Top 0.2: RD-1.2 14.3,21.9 14.3,23.75 TD-1.B
N$13
  Top 0.2: RD-2.2 11,21.9 10.9,22 10.9,23.75 TD-2.B
N$14
  Top 0.2: RE-1.2 21.15,1.95 21.1,2 21.1,3.75 TE-1.B
N$15
  Top 0.2: RA-4.2 0.9,7.9 0.9,9.75 TA-3.B
N$16
  Top 0.2: RE-3.2 31.4,3.8 31.4,3.9 33.25,3.9 TE-2.B
N$17
  Top 0.2: RF-1.2 24.35,21.95 24.3,22 24.3,23.75 TF-1.B
N$18
  Top 0.2: RF-2.2 21,21.9 21,23.75 TF-2.B
N$19
  Top 0.2: TG-1.E 52.95,6.45 53.2,6.7 55.2,6.7 55.5,7 TG-2.C
N$20
  Top 0.2: TF-1.E 26.15,24.25 26.2,24.3 26.2,24.6 25.9,24.9 24,24.9 22.9,26 TF-2.C
N$21
  Top 0.2: RG-1.2 51.6,3.7 51.5,3.7 51.2,4 51.2,5.45 TG-1.B
N$22
  Top 0.2: RG-2.2 54.15,3.65 54.4,3.9 54.4,5.45 TG-2.B
N$23
  Top 0.2: 58.4,5.25 58.23,5.42 | 58.23,5.42 TG-4.B | 58.23,5.42 58.2,5.35 58.1,5.25 58.1,5.1 58.2,5 58.5,5 59.5,4 60.3,4 60.65,3.65 RG-4.2
N$24
  Top 0.2: 61.6,5.55 TG-3.B 61.9,5.25 61.9,5.1 62.6,4.4 62.6,4 62.95,3.65 RG-3.2
N$25
  Top 0.2: RG-6.2 57.95,9.7 TG-6.B
N$26
  Top 0.2: TG-5.B 61.6,9.65 61.6,8.9 61.7,8.8 63.1,8.8 63.2,8.7 63.4,8.5 63.4,6.9 63.2,6.7 63,6.7 55.9,6.7 55.5,6.3 55.5,4.9 55.8,4.6 56.1,4.3 RG-5.2
N$27
  Top 0.2: RH-2.2 31.2,24.6 30.9,24.9 30.6,25.2 30.5,25.3 30.5,30.3 30.8,30.6 TH-1.B
N$28
  Top 0.2: RH-3.2 33.4,24.7 33.1,25 31.6,25 31.4,25.2 31.4,26.05 TH-2.B
N$29
  Top 0.2: TH-2.C 32.3,28.5 32.7,28.9 33.2,29.4 33.2,30.55 TH-1.E
N$30
  Top 0.2: RG-1.1 51.95,1.95 51.95,1.65 51.9,1.6 52.2,1.6 53.3,0.5 53.7,0.5 60.8,0.5 G1.TP 62.5,0.7 62.9,1.1 RG-3.1
N$31
  Top 0.2: RG-4.1 60.65,1.9 60.5,1.9 59.6,1 54.2,1 53.8,1.4 RG-2.1 53.75,2 52.9,2 52.6,2.3 52.4,2.5 52.1,2.8 50.9,2.8 50.6,2.5 50.6,1 50.9,0.7 G2.TP
N$32
  Top 0.2: RH-4.2 35.6,24.6 34.9,25.3 34.9,30.3 35.2,30.6 TH-3.B
N$33
  Top 0.2: RH-5.2 37.8,24.7 37.6,24.9 37.5,25 36,25 35.8,25.2 35.8,26.05 TH-4.B
N$34
  Top 0.2: TH-4.C 36.7,28.5 37.6,29.4 37.6,30.55 TH-3.E
N$35
  Top 0.2: RH-6.2 40,24.6 39.3,25.3 39.3,30.3 39.6,30.6 TH-5.B
N$36
  Top 0.2: RH-7.2 42.2,24.7 41.9,25 40.4,25 40.2,25.2 40.2,26.05 TH-6.B
N$37
  Top 0.2: TH-6.C 41.1,28.5 42,29.4 42,30.55 TH-5.E
N$38
  Top 0.2: RH-8.2 44.4,24.6 43.7,25.3 43.7,30.4 43.9,30.6 TH-7.B
N$39
  Top 0.2: RH-9.2 46.6,24.7 46.3,25 44.8,25 44.6,25.2 44.6,26.05 TH-8.B
N$40
  Top 0.2: TH-8.C 45.5,28.5 46.4,29.4 46.4,30.55 TH-7.E
N$41
  Top 0.2: RH-10.2 48.8,24.6 48.1,25.3 48.1,30.3 48.4,30.6 TH-9.B
N$42
  Top 0.2: RH-11.2 51,24.7 50.7,25 49.1,25 48.9,25.2 48.9,26.05 TH-10.B
N$43
  Top 0.2: TH-10.C 49.9,28.5 50.8,29.4 50.8,30.55 TH-9.E
N$44
  Top 0.2: RH-12.2 53.2,24.6 52.5,25.3 52.5,30.3 52.8,30.6 TH-11.B
N$45
  Top 0.2: RH-13.2 55.4,24.7 55.1,25 53.5,25 53.3,25.2 53.3,26.05 TH-12.B
N$46
  Top 0.2: TH-12.C 54.3,28.5 55.2,29.4 55.2,30.55 TH-11.E
N$47
  Top 0.2: RH-14.2 57.6,24.6 56.9,25.3 56.9,30.3 57.1,30.5 57.65,30.5 TH-13.B
N$48
  Top 0.2: RH-15.2 59.8,24.7 59.5,25 58,25 57.8,25.2 57.8,26.05 TH-14.B
N$49
  Top 0.2: TH-14.C 58.7,28.5 59.6,29.4 59.6,30.55 TH-13.E
N$50
  Top 0.2: RH-16.2 62,24.6 61.3,25.3 61.3,30.3 61.6,30.6 TH-15.B
N$51
  Top 0.2: RH-17.2 64.2,24.7 63.9,25 62.4,25 62.2,25.2 62.2,26.05 TH-16.B
N$52
  Top 0.2: TH-16.C 63.1,28.5 64.1,29.5 64.1,30.55 TH-15.E
N$53
  Top 0.2: RI-2.2 3.15,42.25 2.8,42.6 2.4,43 2.2,43.2 2.1,43.3 2.1,45 1.9,45.2 1.3,45.2 1.1,45.4 1.1,48.25 TI-1.B
N$54
  Top 0.2: RH-18.2 67.9,31.7 67.2,31.7 67,31.5 67,26.7 67,26.5 67.9,25.6 67.9,24.75 TH-17.B
N$55
  Top 0.2: RI-3.2 1,42.5 1.1,42.6 1.1,44.05 TI-2.B
N$56
  Top 0.2: TI-2.C 2.7,46.3 2.9,46.5 2.9,48.25 TI-1.E
N$57
  Top 0.2: TI-3.B 4.9,48.3 4.5,47.9 4.5,43.1 4.5,41.8 4.9,41.4 6.3,41.4 6.5,41.6 6.5,41.9 6.85,42.25 RI-4.2
N$58
  Top 0.2: RI-5.2 5.5,42.2 5.5,44.05 TI-4.B
N$59
  Top 0.2: TI-4.C 7.6,46.3 7.9,46.6 7.9,48.25 TI-3.E
N$60
  Top 0.2: TI-5.B 11.05,47 RI-6.2
N$61
  Top 0.2: 24.5,53.5 TJ-1.B 24.55,53.45 24.6,53.5 23.35,53.5 RJ-1.2
N$62
  Top 0.2: RI-9.2 3.45,37.35 3.5,37.4 4,37.4 4.3,37.7 4.3,39 4.5,39.2 5.35,39.2 TI-6.B
N$63
  Top 0.2: 24.6,50 24.55,49.95 TJ-2.B 24.15,49.95 24.1,50 23.5,50 23,50.5 23,50.85 RJ-2.2
N$64
  Top 0.2: TJ-1.E 24.55,51.55 24.6,51.5 25.6,51.5 26.6,50.5 26.6,49.1 TJ-2.C
N$65
  Top 0.2: 24.6,42.85 TJ-3.B 24.15,42.95 23,44.5 23,44.85 RJ-4.2
N$66
  Top 0.2: TJ-4.B 24.15,46.45 24.1,46.5 23.5,46.5 23,47 23,47.85 RJ-5.2
N$67
  Top 0.2: TJ-11.C 36.1,55.3 35.7,54.9 34,54.9 33.7,54.6 33.7,51.55 TJ-10.E
N$68
  Top 0.2: TJ-7.E 24.45,55.95 24.5,56 24.5,57 25.5,58 26.9,58 TJ-8.C
N$69
  Top 0.2: RJ-12.2 29,46.3 31.15,46.3 RJ-11.1 31.2,45.7 31.4,45.5 34.1,45.5 34.3,45.7 34.3,46.2 34.5,46.4 35.25,46.4 TJ-6.B
N$70  (1 unrouted)
  Top 0.2: RJ-13.2 33.45,43.1 34.8,43.1 35.1,42.8 | TJ-5.B 35.55,43.15 35.9,42.8 35.9,42.4 36.4,41.9 36.4,41.5 36.7,41.2 38.4,41.2 38.6,41.4 38.6,46.1 38.4,46.3 36.9,46.3 36.7,46.5 36.7,47.2 36.5,47.4 36.5,48.6 36,49.1 36,49.15 RJ-10.2
N$71
  Top 0.2: TJ-9.C 28.9,53.7 27.5,55.1 27.5,55.85 TJ-8.E
N$72
  Top 0.2: TJ-7.B 22.55,55.95 22.5,56 | 22.65,55.85 22.5,55.85 TJ-7.B | TJ-7.B 22.55,55.55 22.5,55.5 22.9,55.5 23.9,54.5 27.2,54.5 27.7,54 27.7,50.6 28.95,49.35 RJ-15.2
N$73
  Top 0.2: TJ-8.B 25.55,56.35 25.6,56.4 25.6,56.7 25.9,57 27.3,57 28.1,57.8 RJ-16.2
N$74
  Top 0.2: TJ-9.B 28.65,51.75 28.6,51.8 28.6,52.3 28.9,52.6 30.2,52.6 30.4,52.8 30.4,54.4 30.1,54.7 29.2,54.7 28.85,55.05 RJ-17.2
N$75
  Top 0.2: TJ-12.C 36.1,54.3 37,55.2 37,55.65 TJ-11.E
N$76
  Top 0.2: RJ-19.2 31.2,50 31.7,50.5 31.7,51.15 TJ-10.B
N$77
  Top 0.2: RJ-20.2 33.4,55.8 33.5,55.9 35.05,55.9 TJ-11.B
N$78
  Top 0.2: RJ-21.2 38,52.3 37.7,52.6 35.4,52.6 35.2,52.4 35.2,51.55 TJ-12.B
NAND
  Top 0.2: RB-3.1 1.3,27.65 1.3,27.6 1.9,27 TB-1.C 3.4,26 5,27.6 NAND.TP
NOR
  Top 0.2: 15,26.3 NOR.TP 15,26.3 | 15,26.3 TD-1.C | 15,26.3 TD-1.C | TD-1.C TD-2.C 11.9,27 11.3,27.6 11.3,27.65 RD-3.1
NOT1
  Top 0.2: NOT1.TP 21,8.05 RE-2.1 21.15,6.25 21.4,6 TE-1.C
NOT2
  Top 0.2: NOT2.TP TE-2.C | TE-2.C 35.4,2.8 TE-2.C | TE-2.C 35,2.9 35,5.35 RE-4.1
OR
  Top 0.2: TC-3.C 13.8,12 OR.TP 14,10.45 RC-5.1
SEL_INT
  Top 0.2: TH-1.C TH-3.C TH-5.C TH-7.C TH-9.C TH-11.C TH-13.C TH-15.C 63.3,32.8 65.8,32.8 66.2,32.4 66.2,31.75 RH-18.1 66.2,31.7 66.2,29.55 RH-1.1
SEL_INT1
  Top 0.2: TI-1.C 2.1,50.5 TI-3.C | 7.1,50.9 6.9,50.7 7,50.6 TI-3.C | TI-3.C 7.1,50.4 9,50.4 9.25,50.15 RI-1.1 RI-6.1
SEL_OUT
  Top 0.2: RH-19.1 66.3,27.3 66.5,27.3 66.5,26 66.7,25.8 67,25.5 TH-17.C 67,21.5 66.8,21.3 SEL-OUT.TP
SEL_OUT1
  Top 0.2: TI-5.C 10.1,42.2 9.7,41.8 9.7,41.25 RI-7.1 9.5,40.95 9.5,40.1 9.7,39.9 10.1,39.9 10.3,39.7 10.3,38.1 10,37.8 SEL-I-OUT.TP
XOR
  Top 0.2: 53,11.8 RG-9.1 53.2,11.8 53.2,12.4 53.4,12.6 56.9,12.6 | TG-5.C 62.4,12.5 62.3,12.6 59,12.6 TG-6.C 59,11.7 58.8,12.6 56.9,12.6 | XOR.TP 56.9,12.6

### Text on the board
bPlace: - | +
tStop: lizard / v0.1
Document: 1-Bit SELECT | 3-Bit SELECT | NAND | NOR | AND | XOR | AND | OR | NOT | NOT